# EAGLE design boot_kurz (EAGLE 6.1)
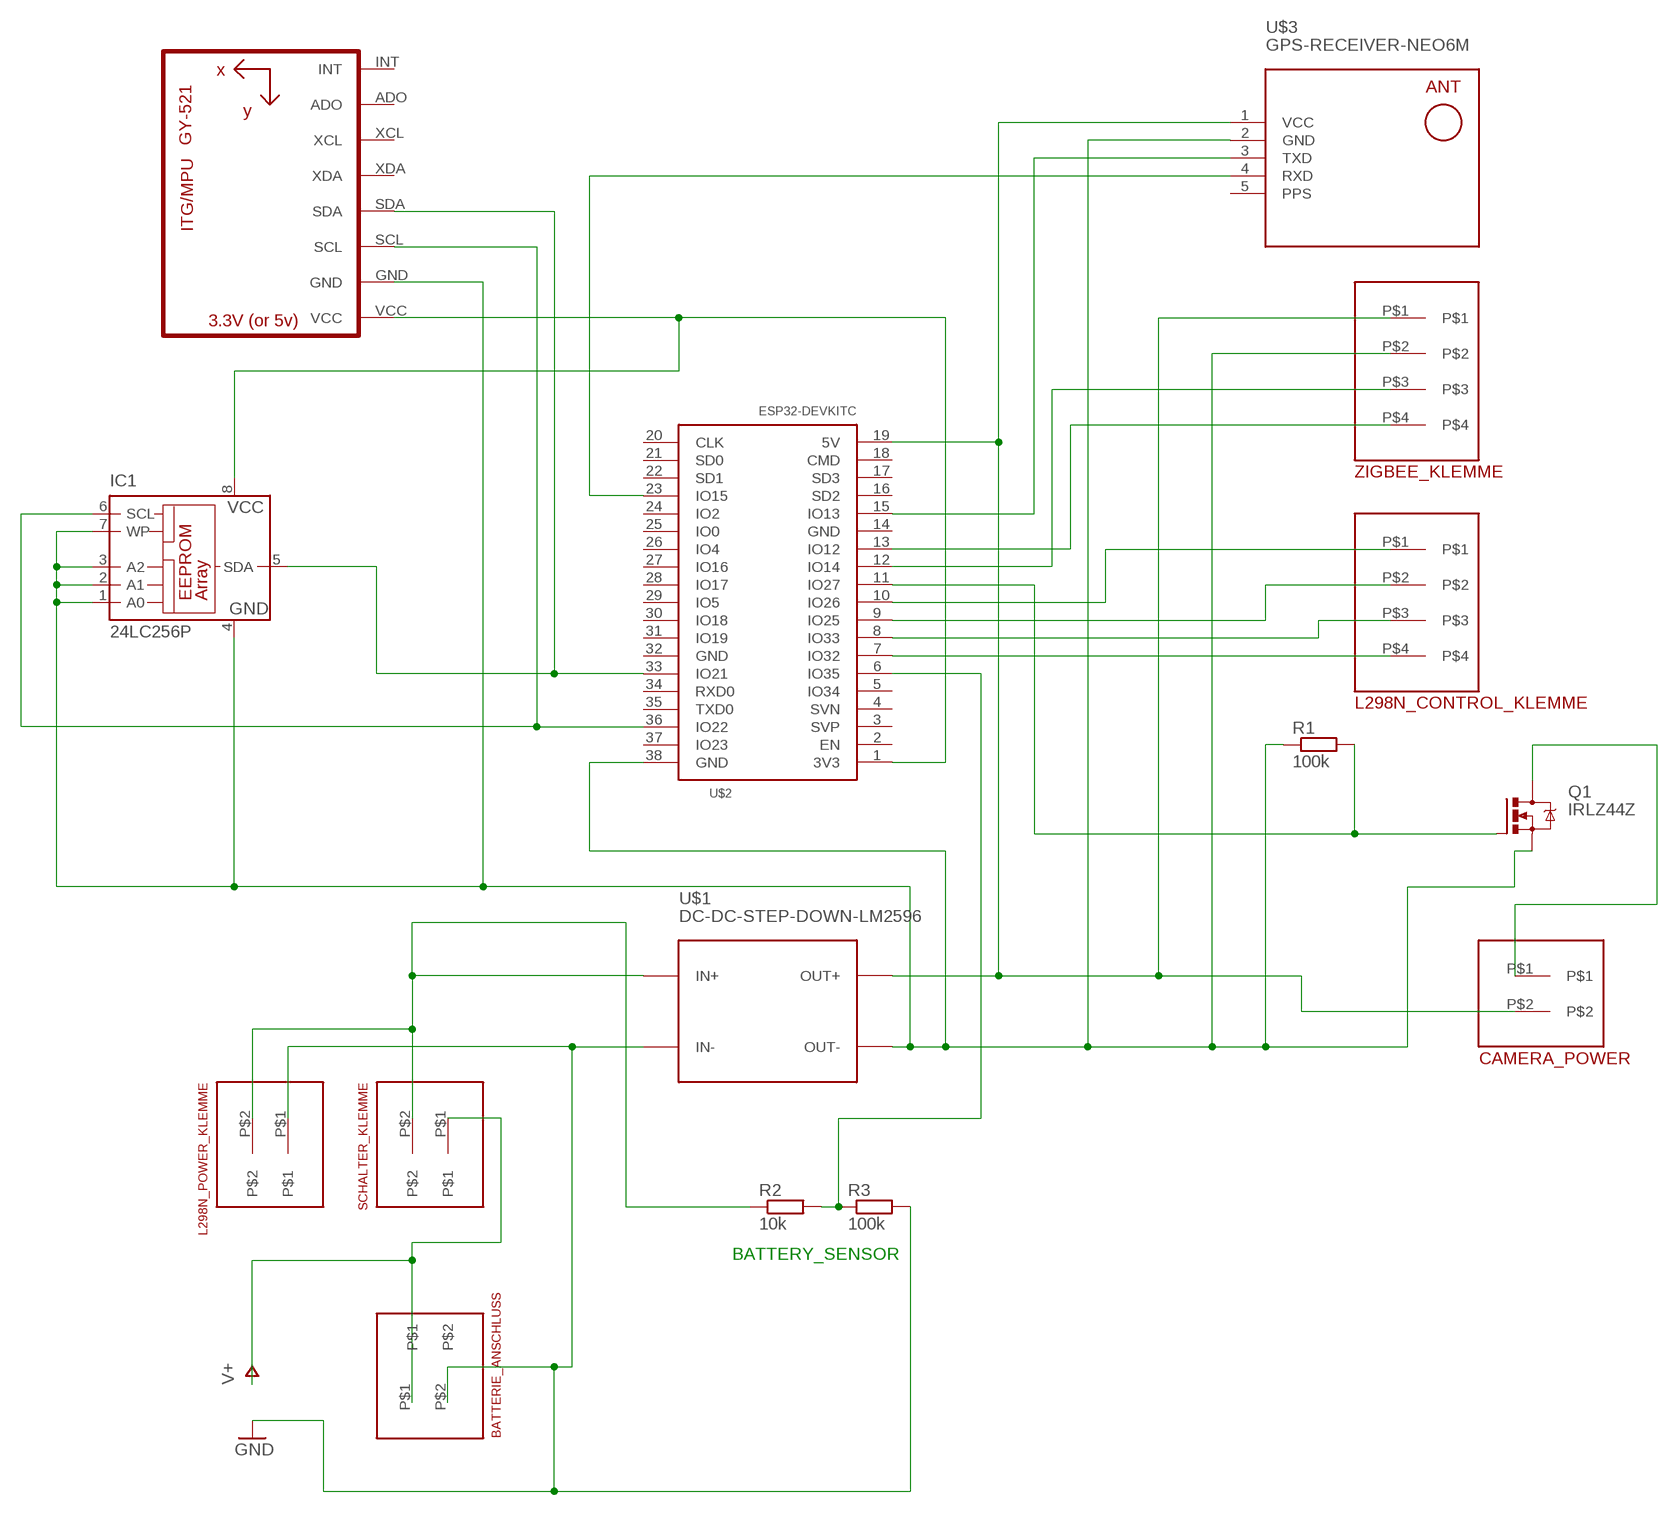
[diagram p0: schematic, sheet 1]

## Parts
BATTERIE_ANSCHLUSS  SCHRAUBKLEMME_X_2RM5.08  [2_PIN_RM5.08]
CAMERA_POWER  AKL_349_X2  [2_PIN_AKL_349_BUCHSE]
IC1  24LC256P  [DIL8]
L298N_CONTROL_KLEMME  SCHRAUBKLEMME_X_4  [4_PIN_RM5.08_SCHRAUBKLEMME]
L298N_POWER_KLEMME  SCHRAUBKLEMME_X_2RM5.08  [2_PIN_RM5.08]
Q1  IRLZ44Z  [TO220BH]
R1  100k  R-EU_0207/7  [0207/7]
R2  10k  R-EU_0207/7  [0207/7]
R3  100k  R-EU_0207/7  [0207/7]
SCHALTER_KLEMME  SCHRAUBKLEMME_X_2RM5.08  [2_PIN_RM5.08]
U1  GY-521MPU6050  [GY-521]
U$1  DC-DC-STEP-DOWN-LM2596  [DC-DC-STEP-DOWN-LM2596]
U$2  ESP32DEVKITC  [ESP32-DEVKITC]
U$3  GPS-RECEIVER-NEO6M  [GPS-RECEIVER-NEO6M]
ZIGBEE_KLEMME  SCHRAUBKLEMME_X_4  [4_PIN_RM5.08_SCHRAUBKLEMME]

## Nets
3.3V: IC1.8(VCC) U1.VCC U$2.1(3V3)
5V: CAMERA_POWER.P$2 U$1.OUT+ U$2.19(5V) U$3.1(VCC) ZIGBEE_KLEMME.P$1
DRAIN: CAMERA_POWER.P$1 Q1.D
GATE: Q1.G R1.2 U$2.11(IO27)
GND: BATTERIE_ANSCHLUSS.P$2 L298N_POWER_KLEMME.P$1 R3.2 U$1.IN-
GROUND: IC1.1(A0) IC1.2(A1) IC1.3(A2) IC1.4(GND) IC1.7(WP) Q1.S R1.1 U1.GND U$1.OUT- U$2.38(GND) U$3.2(GND) ZIGBEE_KLEMME.P$2
N$4: L298N_CONTROL_KLEMME.P$2 U$2.9(IO25)
N$5: L298N_CONTROL_KLEMME.P$3 U$2.8(IO33)
N$6: L298N_CONTROL_KLEMME.P$4 U$2.7(IO32)
N$7: L298N_CONTROL_KLEMME.P$1 U$2.10(IO26)
N$18: R2.2 R3.1 U$2.6(IO35)
RX1: U$2.15(IO13) U$3.3(TXD)
RX2: U$2.12(IO14) ZIGBEE_KLEMME.P$3
SCL: IC1.6(SCL) U1.SCL U$2.36(IO22)
SDA: IC1.5(SDA) U1.SDA U$2.33(IO21)
TX1: U$2.23(IO15) U$3.4(RXD)
TX2: U$2.13(IO12) ZIGBEE_KLEMME.P$4
V+: BATTERIE_ANSCHLUSS.P$1 SCHALTER_KLEMME.P$1
V+_AFTER_SWITCH: L298N_POWER_KLEMME.P$2 R2.1 SCHALTER_KLEMME.P$2 U$1.IN+
Unconnected: U1.ADO U1.INT U1.XCL U1.XDA U$2.2(EN) U$2.3(SVP) U$2.4(SVN) U$2.5(IO34) U$2.14(GND) U$2.16(SD2) U$2.17(SD3) U$2.18(CMD) U$2.20(CLK) U$2.21(SD0) U$2.22(SD1) U$2.24(IO2) U$2.25(IO0) U$2.26(IO4) U$2.27(IO16) U$2.28(IO17) U$2.29(IO5) U$2.30(IO18) U$2.31(IO19) U$2.32(GND) U$2.34(RXD0) U$2.35(TXD0) U$2.37(IO23)

## Notes on the sheet
- BATTERY_SENSOR

## Power pins joined to a net without a drawn wire
PPS: U$3.5(PPS)

## Library data of the parts
BATTERIE_ANSCHLUSS L298N_POWER_KLEMME SCHALTER_KLEMME = eigene:SCHRAUBKLEMME_X_2
CAMERA_POWER = eigene:AKL_349_X2
IC1 = microchip:24*: Serial EEPROM I2C; MF: MICROCHIP; MPN: 24LC256-E/P; OC_FARNELL: 9757970; OC_NEWARK: 92C7169
L298N_CONTROL_KLEMME ZIGBEE_KLEMME = eigene:SCHRAUBKLEMME_X_4
Q1 = transistor-power:IRLZ44Z: N-Channel HEXFET® Power MOSFET Logic Level AUTOMOTIVE MOSFET Source: http://www.irf.com/product-info/datasheets/data/irlz44zpbf.pdf
R1-R3 = resistor:R-EU_: RESISTOR, European symbol
U1 = gy-521:GY-521
U$1 = lm2596_breakout:DC-DC-STEP-DOWN-LM2596: DC/DC Step-Down Regulator based on LM2596-ADJ chip LM2596 datasheet available here: http://www.ti.com/lit/ds/symlink/lm2596.pdf Click here to find device on ebay.com <http://www.ebay.com/sch/lm2596+power+regulator>
U$2 = ESP32-DEVKITC:ESP32DEVKITC
U$3 = diy-modules (1):GPS-RECEIVER-NEO6M: GPS Receiver Module based on NEO-6 device Short tutorial how to use NEO-6 module with Arduino: http://www.xarg.org/2016/06/neo6mv2-gps-module-with-arduino/ NEO-6 datasheet is available here: https://www.u-blox.com/sites/default/files/products/documents/NEO-6_DataSheet_%28GPS.G6-HW-09005%29.pdf Click here to find device on ebay.com <http://www.ebay.com/sch/gyneo6mv2>

## Board
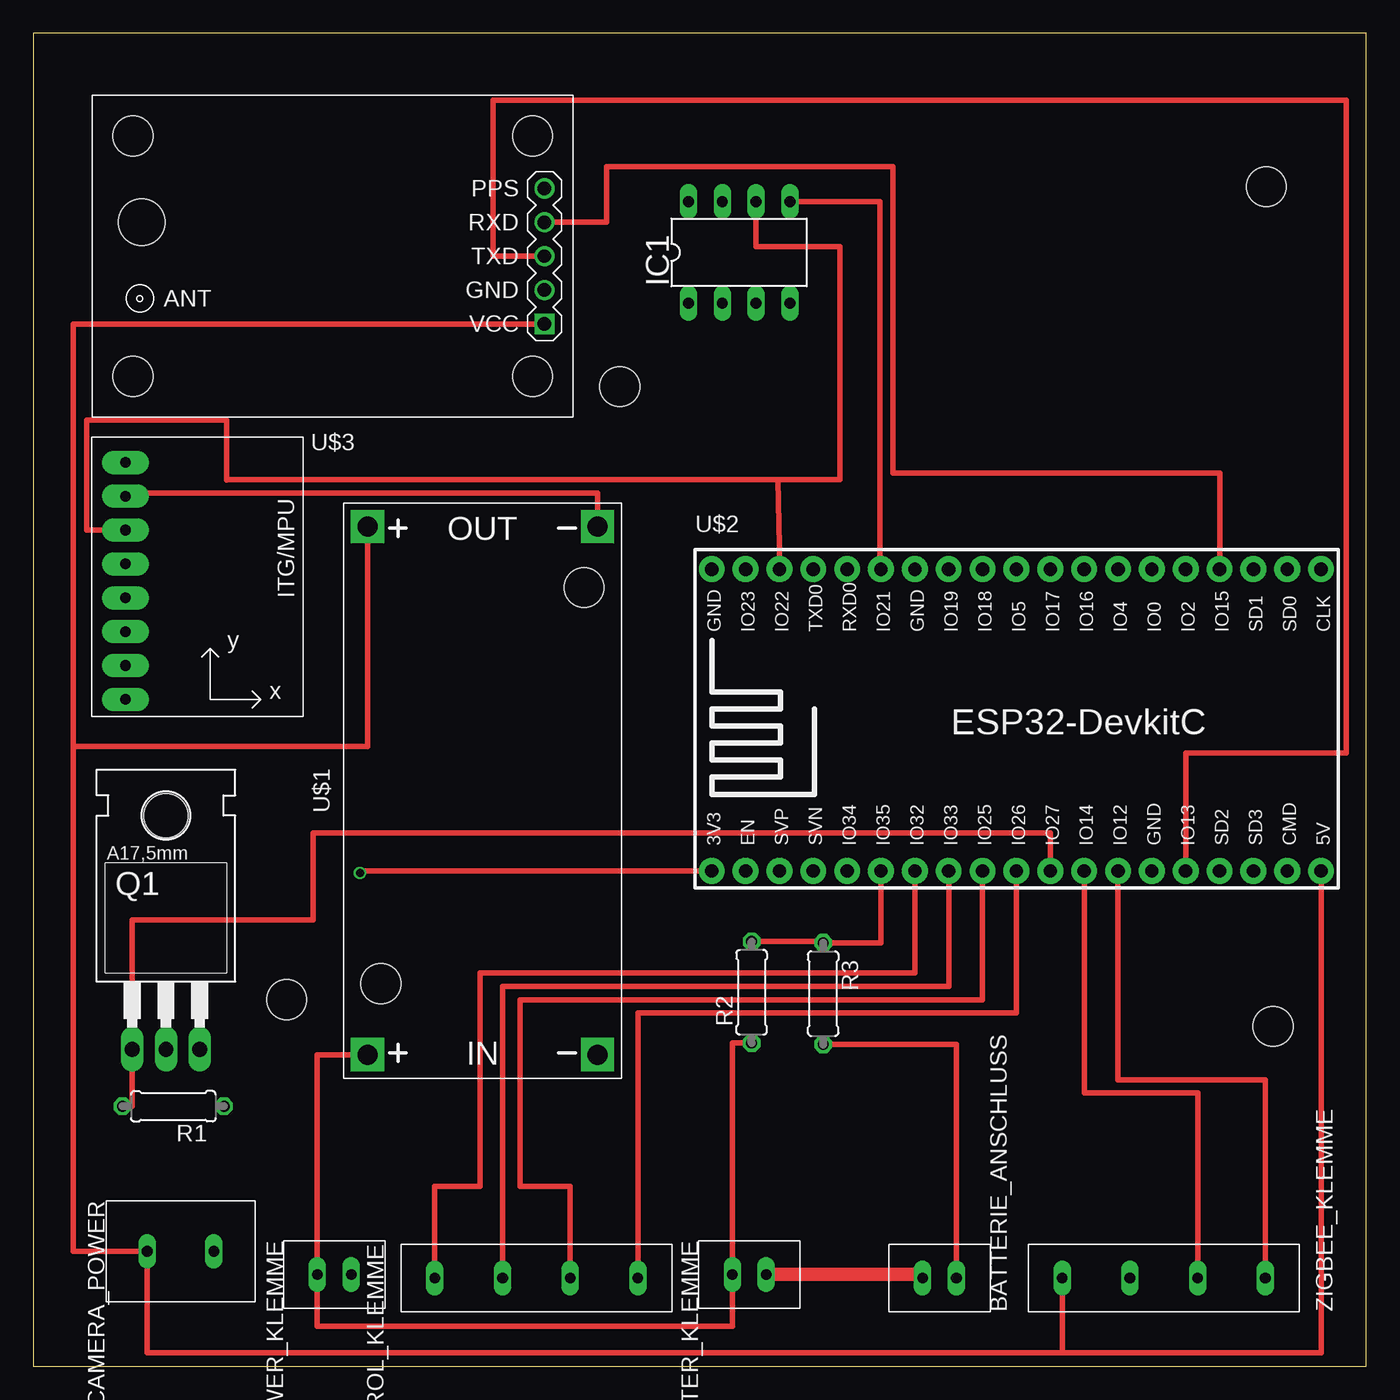
[diagram p1: board, top side]
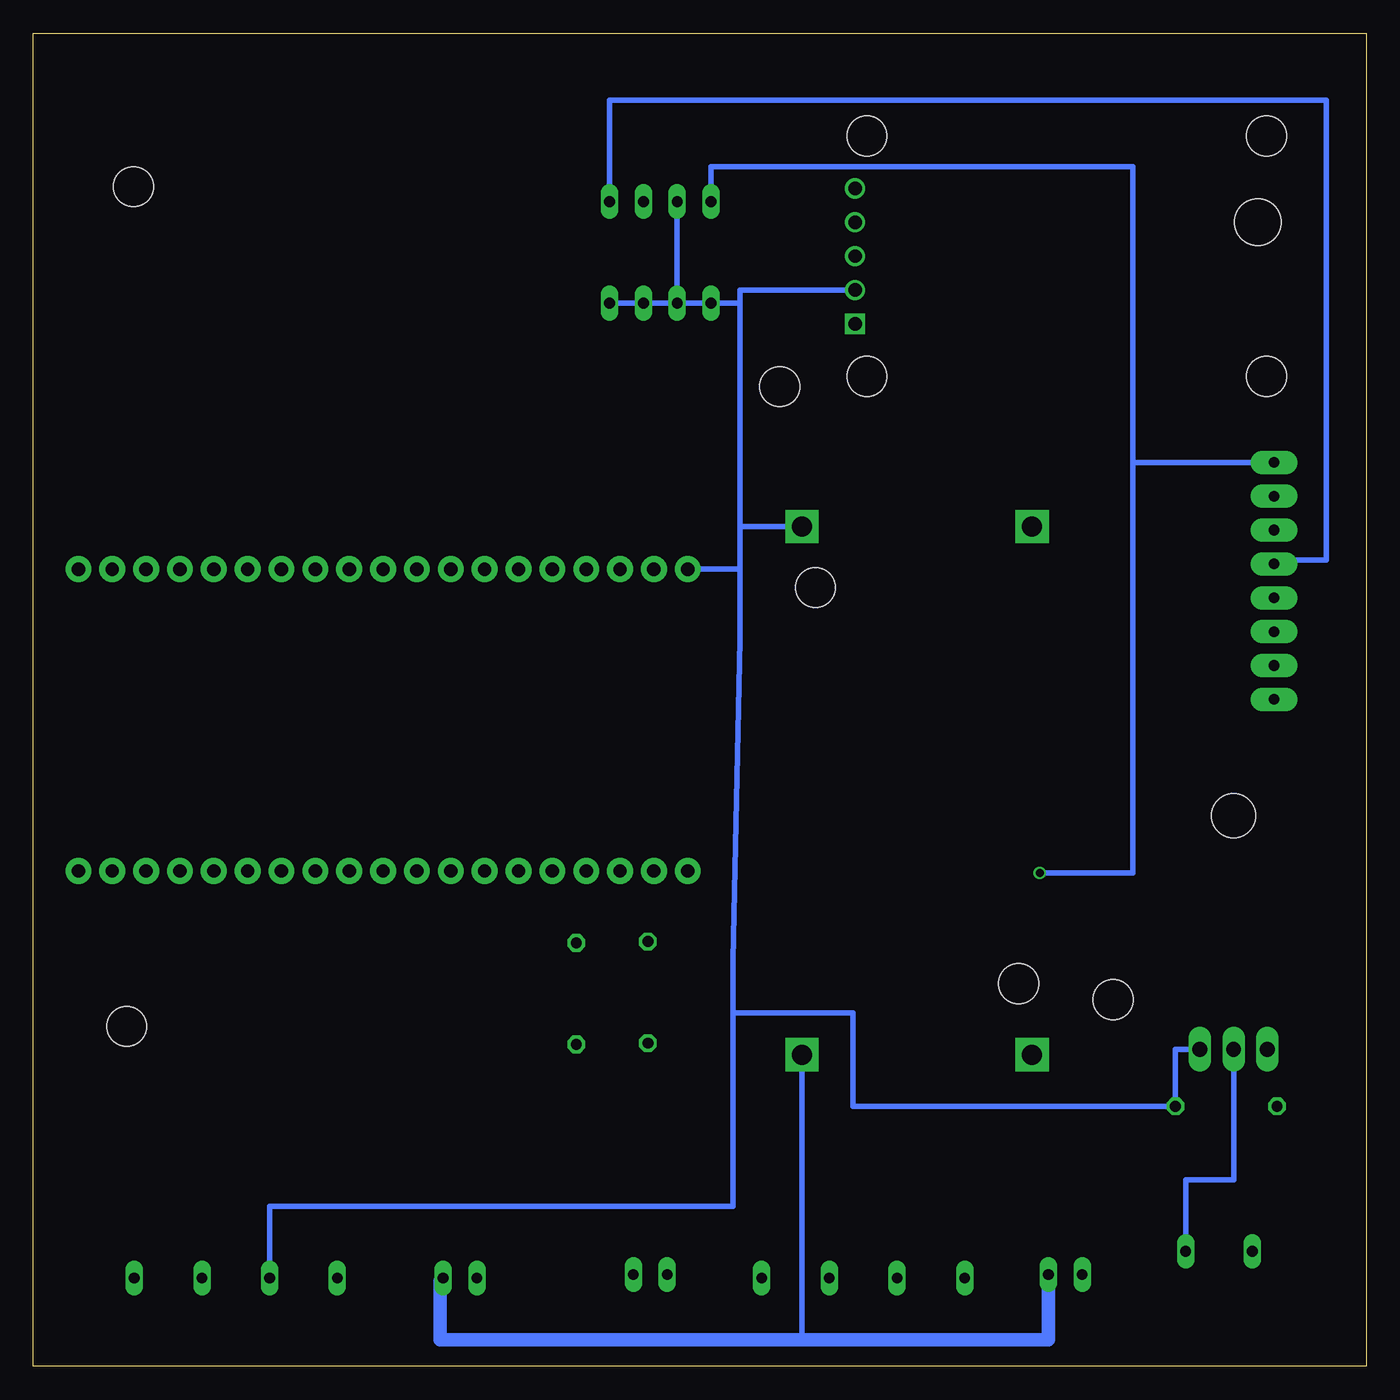
[diagram p2: board, bottom side, seen from below]

Size 100 x 100 mm. Coordinates in mm from the lower left corner, seen from the top.
Outline: 0,0 100,0 100,100 0,100 0,0
Copper layers (1*16): Top 0.035mm / dielectric 1.5mm / Bottom 0.035mm
Design rules: minimum track width 6mil, minimum drill 0.3mm, track to track 6mil, track to pad 6mil, pad to pad 6mil, via to via 6mil, smd to smd 0mil, copper to edge 10mil, drill to drill 10mil, minimum pad ring 10mil, minimum via ring 6mil, stop-mask expansion 2mil, vias tented up to drill 100mil, thermal gap 10mil
Holes 3 mm at 92.5,88.5 93,25.5 19,27.5 44,73.5

### Footprints (pad centres in the part's own frame; a part is rotated, then mirrored left to right if it is on the bottom)
2_PIN_RM5.08 = drill 0.8 long: P$1 0,1.27; P$2 0,-1.27
2_PIN_AKL_349_BUCHSE = drill 0.8 long: P$1 0,3.1; P$2 0,-1.9
DIL8 = drill 0.813 long: 1 -3.81,-3.81; 2 -1.27,-3.81; 3 1.27,-3.81; 4 3.81,-3.81; 5 3.81,3.81; 6 1.27,3.81; 7 -1.27,3.81; 8 -3.81,3.81
4_PIN_RM5.08_SCHRAUBKLEMME = drill 0.8 long: P$1 -2.54,10.16; P$2 -2.54,5.08; P$3 -2.54,0; P$4 -2.54,-5.08
TO220BH = drill 1.118 long: D 0,-6.35; G -2.54,-6.35; S 2.54,-6.35 | hole 3.302: 0,11.176
0207/7 = drill 0.813 octagon: 1 -3.81,0; 2 3.81,0
GY-521 = drill 0.8 pad 1.778 long: ADO -8.89,-6.35; GND -8.89,6.35; INT -8.89,-8.89; SCL -8.89,3.81; SDA -8.89,1.27; VCC -8.89,8.89; XCL -8.89,-3.81; XDA -8.89,-1.27
DC-DC-STEP-DOWN-LM2596 = drill 1.5 pad 2.5 square: IN+ -19.812,8.636; IN- -19.812,-8.636; OUT+ 19.812,8.636; OUT- 19.812,-8.636 | hole 3: -14.478,7.62; 15.24,-7.62
ESP32-DEVKITC = drill 1 pad 1.93: 1 -22.87,-11.42; 2 -20.33,-11.42; 3 -17.79,-11.42; 4 -15.25,-11.42; 5 -12.71,-11.42; 6 -10.17,-11.42; 7 -7.63,-11.42; 8 -5.09,-11.42; 9 -2.55,-11.42; 10 -0.01,-11.42; 11 2.53,-11.42; 12 5.07,-11.42; 13 7.61,-11.42; 14 10.15,-11.42; 15 12.69,-11.42; 16 15.23,-11.42; 17 17.77,-11.42; 18 20.31,-11.42; 19 22.85,-11.42; 20 22.85,11.23; 21 20.31,11.23; 22 17.77,11.23; 23 15.23,11.23; 24 12.69,11.23; 25 10.15,11.23; 26 7.61,11.23; 27 5.07,11.23; 28 2.53,11.23; 29 -0.01,11.23; 30 -2.55,11.23; 31 -5.09,11.23; 32 -7.63,11.23; 33 -10.17,11.23; 34 -12.71,11.23; 35 -15.25,11.23; 36 -17.79,11.23; 37 -20.33,11.23; 38 -22.87,11.23
GPS-RECEIVER-NEO6M = drill 1 square: 1 -15.875,5.08 | drill 1: 2 -15.875,2.54; 3 -15.875,0; 4 -15.875,-2.54; 5 -15.875,-5.08 | hole 3: -14.986,9.017; -14.986,-9.017; 14.986,-9.017; 14.986,9.017 | hole 3.5: 14.351,-2.54

### Placement (x,y rotation side)
BATTERIE_ANSCHLUSS  67.99,6.62 90 top
CAMERA_POWER  10.45,8.62 270 top
IC1  52.96,83.57 0 top
L298N_CONTROL_KLEMME  35.2,4.08 270 top
L298N_POWER_KLEMME  22.58,6.88 270 top
Q1  9.95,30.13 0 top
R1  10.5,19.5 180 top
R2  53.89,28.05 90 top
R3  59.26,27.95 270 top
SCHALTER_KLEMME  53.71,6.88 270 top
U1  15.8,58.92 0 top
U$1  33.7,43.18 90 top
U$2  73.77,48.57 0 top
U$3  22.47,83.28 180 top
ZIGBEE_KLEMME  87.35,9.16 90 top

### Tracks (layer width: path | path; a pad name or v marks a point on that pad's centre or on a via)
3.3V  (via drill 0.6)
  Top 0.406: U$2.1 24.5,37.15 v24.5,37
  Bottom 0.406: 17.5,67.81 U1.VCC | 17.5,67.81 17.5,90 49.15,90 IC1.8 | v24.5,37 17.5,37 17.5,67.81
5V
  Top 0.406: ZIGBEE_KLEMME.P$1 77.19,1 | 77.19,1 8.55,1 CAMERA_POWER.P$2 3,8.62 3,46.5 | U$2.19 96.62,1 77.19,1 | U$3.1 3,78.2 3,46.5 | U$1.OUT+ 25.06,46.5 3,46.5
DRAIN
  Bottom 0.406: Q1.D 9.95,14 13.55,14 CAMERA_POWER.P$1
GATE
  Top 0.406: U$2.11 76.3,40 21,40 21,33.5 7.41,33.5 Q1.G 7.41,19.5 R1.2
GND
  Top 0.406: BATTERIE_ANSCHLUSS.P$2 69.26,24.14 R3.2
  Bottom 0.406: U$1.IN- 42.34,2 42.5,2
  Bottom 1.016: BATTERIE_ANSCHLUSS.P$2 69.5,6.38 69.5,2 42.5,2 | L298N_POWER_KLEMME.P$1 23.85,2 42.34,2
GROUND
  Top 0.406: U$1.OUT- 42.34,65.5 6.91,65.5 U1.GND
  Bottom 0.406: 50.9,60 U$2.38 47,59.8 | IC1.7 IC1.2 | IC1.2 IC1.3 IC1.4 | 47.5,26.5 47.5,30.5 47,54.5 47,59.8 | 47.5,26.5 47.5,12 82.27,12 ZIGBEE_KLEMME.P$2 | U$1.OUT- 47,62.99 | 47,62.99 47,59.8 | 47.5,26.5 38.5,26.5 38.5,19.5 R1.1 14.31,23.78 Q1.S | 47,79.76 IC1.1 IC1.2 | 47,79.76 47,62.99 | 47,79.76 47,80.74 U$3.2
N$4
  Top 0.406: U$2.9 71.22,27.5 37,27.5 36.5,27.5 36.5,13.5 40.28,13.5 L298N_CONTROL_KLEMME.P$2
N$5
  Top 0.406: U$2.8 68.68,28.5 65.5,28.5 65,28.5 35.2,28.5 L298N_CONTROL_KLEMME.P$3
N$6
  Top 0.406: U$2.7 66.14,29.5 33.5,29.5 33.5,13.5 30.12,13.5 L298N_CONTROL_KLEMME.P$4
N$7
  Top 0.406: L298N_CONTROL_KLEMME.P$1 45.36,26.5 73.76,26.5 U$2.10
N$18
  Top 0.406: U$2.6 63.6,31.76 R3.1 59.26,31.86 R2.2
RX1
  Top 0.406: U$2.15 86.46,46 98.5,46 98.5,95 34.5,95 34.5,83.28 U$3.3
RX2
  Top 0.406: ZIGBEE_KLEMME.P$3 87.35,20.5 82,20.5 81.5,20.5 78.84,20.5 U$2.12
SCL
  Top 0.406: U$2.36 56,59.82 55.86,66.51 | 14.5,66.51 14.5,71 4,71 4,62.73 U1.SCL | 14.5,66.5 14.5,66.51 | 14.5,66.51 55.86,66.51 | IC1.6 54.23,84 60.5,84 60.5,66.51 55.86,66.51
SDA
  Top 0.406: IC1.5 63.5,87.38 63.5,59.8 U$2.33
  Bottom 0.406: U1.SDA 6.6,60.5 3,60.5 3,95 37,95 37.5,95 56.77,95 IC1.5
TX1
  Top 0.406: U$3.4 43,85.82 43,90 64.5,90 64.5,67 89,67 U$2.23
TX2
  Top 0.406: U$2.13 81.38,21.5 92.43,21.5 ZIGBEE_KLEMME.P$4
V+
  Top 1.016: BATTERIE_ANSCHLUSS.P$1 66.46,6.88 SCHALTER_KLEMME.P$1
V+_AFTER_SWITCH
  Top 0.406: R2.1 52.44,24.24 SCHALTER_KLEMME.P$2 52.44,3 21.31,3 L298N_POWER_KLEMME.P$2 21.31,23.37 U$1.IN+